# Altium schematic sheet DSP.SchDoc: <title>
size A4; Organization: Institut d'Automatisation Industrielle; SheetNumber: 3; SheetTotal: 3; SVN: OUI; CurrentTime: 6; CurrentDate: 5; DocumentFullPathAndName: 8; DocumentName: 9; ModifiedDate: 13; ProjectName: <projet>
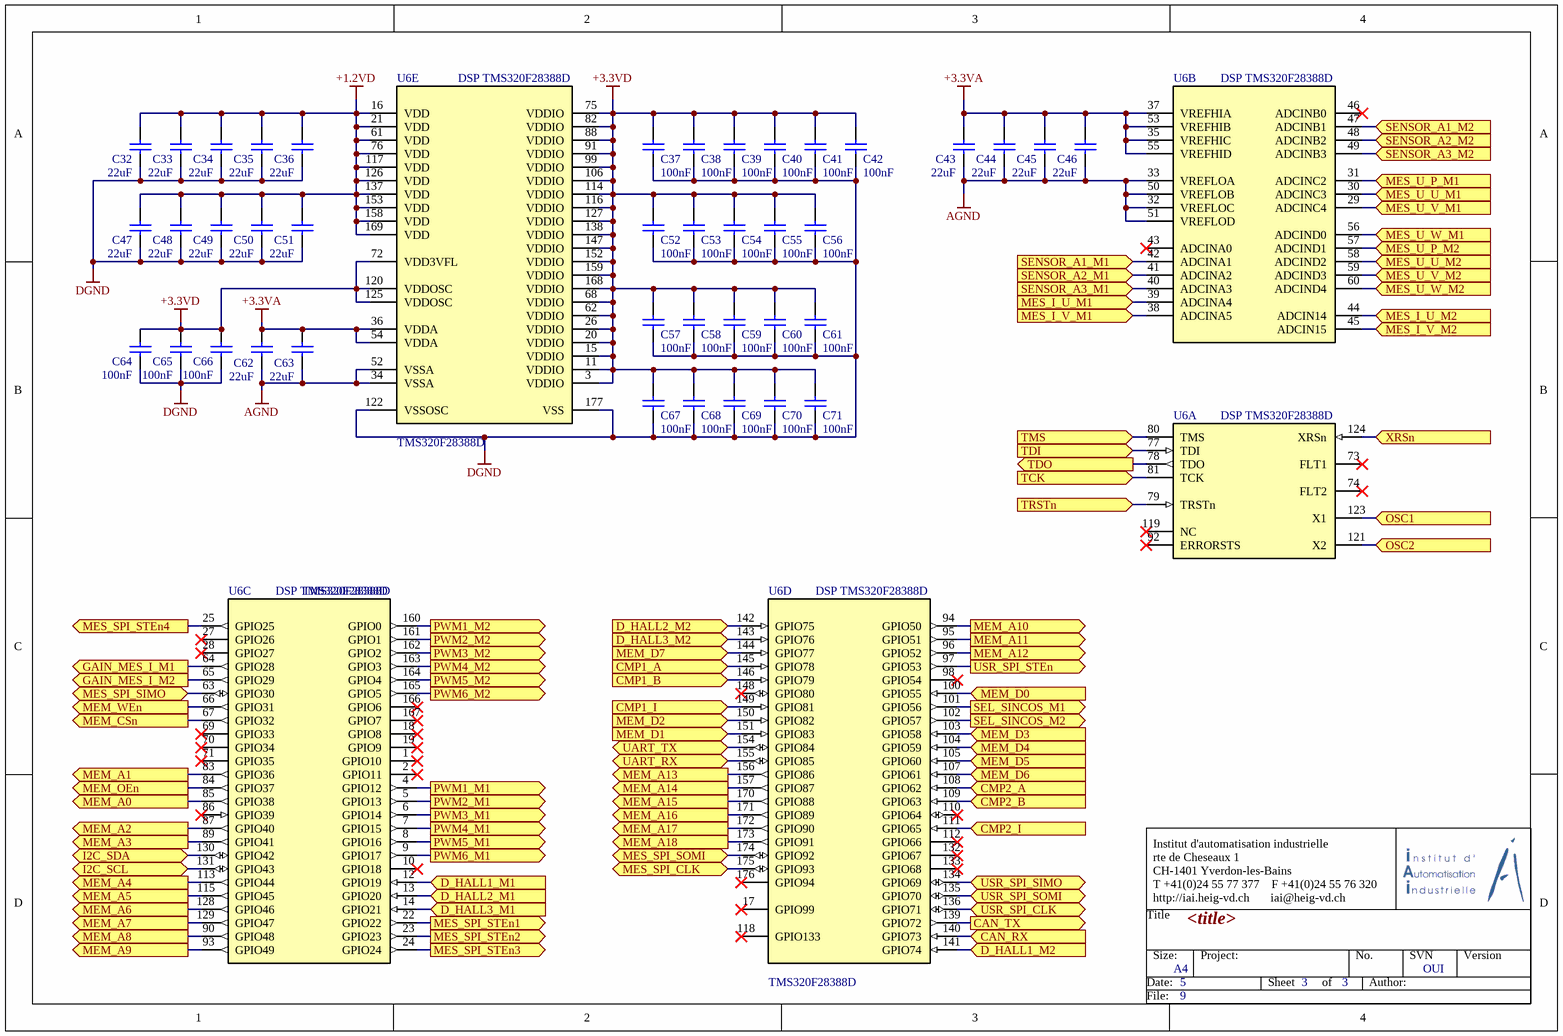
[diagram p0: DSP.SchDoc]

## Parts
C32  value 22uF  [CAPC1608X08N]  (hidden comment: CAP CER 22uF 0603)
C33  value 22uF  [CAPC1608X08N]  (hidden comment: CAP CER 22uF 0603)
C34  value 22uF  [CAPC1608X08N]  (hidden comment: CAP CER 22uF 0603)
C35  value 22uF  [CAPC1608X08N]  (hidden comment: CAP CER 22uF 0603)
C36  value 22uF  [CAPC1608X08N]  (hidden comment: CAP CER 22uF 0603)
C37  value 100nF  [CAPC1608X08N]  (hidden comment: CAP CER 100nF 0603)
C38  value 100nF  [CAPC1608X08N]  (hidden comment: CAP CER 100nF 0603)
C39  value 100nF  [CAPC1608X08N]  (hidden comment: CAP CER 100nF 0603)
C40  value 100nF  [CAPC1608X08N]  (hidden comment: CAP CER 100nF 0603)
C41  value 100nF  [CAPC1608X08N]  (hidden comment: CAP CER 100nF 0603)
C42  value 100nF  [CAPC1608X08N]  (hidden comment: CAP CER 100nF 0603)
C43  value 22uF  [CAPC1608X08N]  (hidden comment: CAP CER 22uF 0603)
C44  value 22uF  [CAPC1608X08N]  (hidden comment: CAP CER 22uF 0603)
C45  value 22uF  [CAPC1608X08N]  (hidden comment: CAP CER 22uF 0603)
C46  value 22uF  [CAPC1608X08N]  (hidden comment: CAP CER 22uF 0603)
C47  value 22uF  [CAPC1608X08N]  (hidden comment: CAP CER 22uF 0603)
C48  value 22uF  [CAPC1608X08N]  (hidden comment: CAP CER 22uF 0603)
C49  value 22uF  [CAPC1608X08N]  (hidden comment: CAP CER 22uF 0603)
C50  value 22uF  [CAPC1608X08N]  (hidden comment: CAP CER 22uF 0603)
C51  value 22uF  [CAPC1608X08N]  (hidden comment: CAP CER 22uF 0603)
C52  value 100nF  [CAPC1608X08N]  (hidden comment: CAP CER 100nF 0603)
C53  value 100nF  [CAPC1608X08N]  (hidden comment: CAP CER 100nF 0603)
C54  value 100nF  [CAPC1608X08N]  (hidden comment: CAP CER 100nF 0603)
C55  value 100nF  [CAPC1608X08N]  (hidden comment: CAP CER 100nF 0603)
C56  value 100nF  [CAPC1608X08N]  (hidden comment: CAP CER 100nF 0603)
C57  value 100nF  [CAPC1608X08N]  (hidden comment: CAP CER 100nF 0603)
C58  value 100nF  [CAPC1608X08N]  (hidden comment: CAP CER 100nF 0603)
C59  value 100nF  [CAPC1608X08N]  (hidden comment: CAP CER 100nF 0603)
C60  value 100nF  [CAPC1608X08N]  (hidden comment: CAP CER 100nF 0603)
C61  value 100nF  [CAPC1608X08N]  (hidden comment: CAP CER 100nF 0603)
C62  value 22uF  [CAPC1608X08N]  (hidden comment: CAP CER 22uF 0603)
C63  value 22uF  [CAPC1608X08N]  (hidden comment: CAP CER 22uF 0603)
C64  value 100nF  [CAPC1608X08N]  (hidden comment: CAP CER 100nF 0603)
C65  value 100nF  [CAPC1608X08N]  (hidden comment: CAP CER 100nF 0603)
C66  value 100nF  [CAPC1608X08N]  (hidden comment: CAP CER 100nF 0603)
C67  value 100nF  [CAPC1608X08N]  (hidden comment: CAP CER 100nF 0603)
C68  value 100nF  [CAPC1608X08N]  (hidden comment: CAP CER 100nF 0603)
C69  value 100nF  [CAPC1608X08N]  (hidden comment: CAP CER 100nF 0603)
C70  value 100nF  [CAPC1608X08N]  (hidden comment: CAP CER 100nF 0603)
C71  value 100nF  [CAPC1608X08N]  (hidden comment: CAP CER 100nF 0603)
U6  DSP TMS320F28388D  [TSQFP50P2600X2600X160_HS-177N]  (parts A,B,C,D,E of 5)

## Ports
CAN_RX (in), CAN_TX (out), CMP1_A (in), CMP1_B (in), CMP1_I (in), CMP2_A (in), CMP2_B (in), CMP2_I (in), D_HALL1_M1 (in), D_HALL1_M2 (in), D_HALL2_M1 (in), D_HALL2_M2 (in), D_HALL3_M1 (in), D_HALL3_M2 (in), GAIN_MES_I_M1 (out), GAIN_MES_I_M2 (out), I2C_SCL (bidir), I2C_SDA (bidir), MEM_A0 (out), MEM_A1 (out), MEM_A2 (out), MEM_A3 (out), MEM_A4 (out), MEM_A5 (out), MEM_A6 (out), MEM_A7 (out), MEM_A8 (out), MEM_A9 (out), MEM_A10 (out), MEM_A11 (out), MEM_A12 (out), MEM_A13 (out), MEM_A14 (out), MEM_A15 (out), MEM_A16 (out), MEM_A17 (out), MEM_A18 (out), MEM_CSn (out), MEM_D0 (in), MEM_D1 (in), MEM_D2 (in), MEM_D3 (in), MEM_D4 (in), MEM_D5 (in), MEM_D6 (in), MEM_D7 (in), MEM_OEn (out), MEM_WEn (out), MES_I_U_M1 (in), MES_I_U_M2 (in), MES_I_V_M1 (in), MES_I_V_M2 (in), MES_SPI_CLK (bidir), MES_SPI_SIMO (bidir), MES_SPI_SOMI (bidir), MES_SPI_STEn1 (out), MES_SPI_STEn2 (out), MES_SPI_STEn3 (out), MES_SPI_STEn4 (out), MES_U_P_M1 (in), MES_U_P_M2 (in), MES_U_U_M1 (in), MES_U_U_M2 (in), MES_U_V_M1 (in), MES_U_V_M2 (in), MES_U_W_M1 (in), MES_U_W_M2 (in), OSC1 (in), OSC2 (in), PWM1_M1 (out), PWM1_M2 (out), PWM2_M1 (out), PWM2_M2 (out), PWM3_M1 (out), PWM3_M2 (out), PWM4_M1 (out), PWM4_M2 (out), PWM5_M1 (out), PWM5_M2 (out), PWM6_M1 (out), PWM6_M2 (out), SEL_SINCOS_M1 (out), SEL_SINCOS_M2 (out), SENSOR_A1_M1 (in), SENSOR_A1_M2 (in), SENSOR_A2_M1 (in), SENSOR_A2_M2 (in), SENSOR_A3_M1 (in), SENSOR_A3_M2 (in), TCK (in), TDI (in), TDO (out), TMS (in), TRSTn (in), UART_RX (bidir), UART_TX (bidir), USR_SPI_CLK (bidir), USR_SPI_SIMO (bidir), USR_SPI_SOMI (bidir), USR_SPI_STEn (out), XRSn (in)

## Nets
+1.2VD: C32.2 C33.2 C34.2 C35.2 C36.2 C47.2 C48.2 C49.2 C50.2 C51.2 U6.16(VDD) U6.21(VDD) U6.61(VDD) U6.76(VDD) U6.117(VDD) U6.126(VDD) U6.137(VDD) U6.153(VDD) U6.158(VDD) U6.169(VDD)
+3.3VA: C43.2 C44.2 C45.2 C46.2 C62.2 C63.2 U6.35(VREFHIC) U6.36(VDDA) U6.37(VREFHIA) U6.53(VREFHIB) U6.54(VDDA) U6.55(VREFHID)
+3.3VD: C37.2 C38.2 C39.2 C40.2 C41.2 C42.2 C52.2 C53.2 C54.2 C55.2 C56.2 C57.2 C58.2 C59.2 C60.2 C61.2 C64.2 C65.2 C66.2 C67.2 C68.2 C69.2 C70.2 C71.2 U6.3(VDDIO) U6.11(VDDIO) U6.15(VDDIO) U6.20(VDDIO) U6.26(VDDIO) U6.62(VDDIO) U6.68(VDDIO) U6.72(VDD3VFL) U6.75(VDDIO) U6.82(VDDIO) U6.88(VDDIO) U6.91(VDDIO) U6.99(VDDIO) U6.106(VDDIO) U6.114(VDDIO) U6.116(VDDIO) U6.120(VDDOSC) U6.125(VDDOSC) U6.127(VDDIO) U6.138(VDDIO) U6.147(VDDIO) U6.152(VDDIO) U6.159(VDDIO) U6.168(VDDIO)
AGND: C43.1 C44.1 C45.1 C46.1 C62.1 C63.1 U6.32(VREFLOC) U6.33(VREFLOA) U6.34(VSSA) U6.50(VREFLOB) U6.51(VREFLOD) U6.52(VSSA)
DGND: C32.1 C33.1 C34.1 C35.1 C36.1 C37.1 C38.1 C39.1 C40.1 C41.1 C42.1 C47.1 C48.1 C49.1 C50.1 C51.1 C52.1 C53.1 C54.1 C55.1 C56.1 C57.1 C58.1 C59.1 C60.1 C61.1 C64.1 C65.1 C66.1 C67.1 C68.1 C69.1 C70.1 C71.1 U6.122(VSSOSC) U6.177(VSS)
CAN_RX: U6.140(GPIO73) ; port CAN_RX
CAN_TX: U6.139(GPIO72) ; port CAN_TX
CMP1_A: U6.145(GPIO78) ; port CMP1_A
CMP1_B: U6.146(GPIO79) ; port CMP1_B
CMP1_I: U6.149(GPIO81) ; port CMP1_I
CMP2_A: U6.108(GPIO62) ; port CMP2_A
CMP2_B: U6.109(GPIO63) ; port CMP2_B
CMP2_I: U6.111(GPIO65) ; port CMP2_I
D_HALL1_M1: U6.12(GPIO19) ; port D_HALL1_M1
D_HALL1_M2: U6.141(GPIO74) ; port D_HALL1_M2
D_HALL2_M1: U6.13(GPIO20) ; port D_HALL2_M1
D_HALL2_M2: U6.142(GPIO75) ; port D_HALL2_M2
D_HALL3_M1: U6.14(GPIO21) ; port D_HALL3_M1
D_HALL3_M2: U6.143(GPIO76) ; port D_HALL3_M2
GAIN_MES_I_M1: U6.64(GPIO28) ; port GAIN_MES_I_M1
GAIN_MES_I_M2: U6.65(GPIO29) ; port GAIN_MES_I_M2
I2C_SCL: U6.131(GPIO43) ; port I2C_SCL
I2C_SDA: U6.130(GPIO42) ; port I2C_SDA
MEM_A0: U6.85(GPIO38) ; port MEM_A0
MEM_A1: U6.83(GPIO36) ; port MEM_A1
MEM_A2: U6.87(GPIO40) ; port MEM_A2
MEM_A3: U6.89(GPIO41) ; port MEM_A3
MEM_A4: U6.113(GPIO44) ; port MEM_A4
MEM_A5: U6.115(GPIO45) ; port MEM_A5
MEM_A6: U6.128(GPIO46) ; port MEM_A6
MEM_A7: U6.129(GPIO47) ; port MEM_A7
MEM_A8: U6.90(GPIO48) ; port MEM_A8
MEM_A9: U6.93(GPIO49) ; port MEM_A9
MEM_A10: U6.94(GPIO50) ; port MEM_A10
MEM_A11: U6.95(GPIO51) ; port MEM_A11
MEM_A12: U6.96(GPIO52) ; port MEM_A12
MEM_A13: U6.156(GPIO86) ; port MEM_A13
MEM_A14: U6.157(GPIO87) ; port MEM_A14
MEM_A15: U6.170(GPIO88) ; port MEM_A15
MEM_A16: U6.171(GPIO89) ; port MEM_A16
MEM_A17: U6.172(GPIO90) ; port MEM_A17
MEM_A18: U6.173(GPIO91) ; port MEM_A18
MEM_CSn: U6.67(GPIO32) ; port MEM_CSn
MEM_D0: U6.100(GPIO55) ; port MEM_D0
MEM_D1: U6.151(GPIO83) ; port MEM_D1
MEM_D2: U6.150(GPIO82) ; port MEM_D2
MEM_D3: U6.103(GPIO58) ; port MEM_D3
MEM_D4: U6.104(GPIO59) ; port MEM_D4
MEM_D5: U6.105(GPIO60) ; port MEM_D5
MEM_D6: U6.107(GPIO61) ; port MEM_D6
MEM_D7: U6.144(GPIO77) ; port MEM_D7
MEM_OEn: U6.84(GPIO37) ; port MEM_OEn
MEM_WEn: U6.66(GPIO31) ; port MEM_WEn
MES_I_U_M1: U6.39(ADCINA4) ; port MES_I_U_M1
MES_I_U_M2: U6.44(ADCIN14) ; port MES_I_U_M2
MES_I_V_M1: U6.38(ADCINA5) ; port MES_I_V_M1
MES_I_V_M2: U6.45(ADCIN15) ; port MES_I_V_M2
MES_SPI_CLK: U6.175(GPIO93) ; port MES_SPI_CLK
MES_SPI_SIMO: U6.63(GPIO30) ; port MES_SPI_SIMO
MES_SPI_SOMI: U6.174(GPIO92) ; port MES_SPI_SOMI
MES_SPI_STEn1: U6.22(GPIO22) ; port MES_SPI_STEn1
MES_SPI_STEn2: U6.23(GPIO23) ; port MES_SPI_STEn2
MES_SPI_STEn3: U6.24(GPIO24) ; port MES_SPI_STEn3
MES_SPI_STEn4: U6.25(GPIO25) ; port MES_SPI_STEn4
MES_U_P_M1: U6.31(ADCINC2) ; port MES_U_P_M1
MES_U_P_M2: U6.57(ADCIND1) ; port MES_U_P_M2
MES_U_U_M1: U6.30(ADCINC3) ; port MES_U_U_M1
MES_U_U_M2: U6.58(ADCIND2) ; port MES_U_U_M2
MES_U_V_M1: U6.29(ADCINC4) ; port MES_U_V_M1
MES_U_V_M2: U6.59(ADCIND3) ; port MES_U_V_M2
MES_U_W_M1: U6.56(ADCIND0) ; port MES_U_W_M1
MES_U_W_M2: U6.60(ADCIND4) ; port MES_U_W_M2
OSC1: U6.123(X1) ; port OSC1
OSC2: U6.121(X2) ; port OSC2
PWM1_M1: U6.4(GPIO12) ; port PWM1_M1
PWM1_M2: U6.160(GPIO0) ; port PWM1_M2
PWM2_M1: U6.5(GPIO13) ; port PWM2_M1
PWM2_M2: U6.161(GPIO1) ; port PWM2_M2
PWM3_M1: U6.6(GPIO14) ; port PWM3_M1
PWM3_M2: U6.162(GPIO2) ; port PWM3_M2
PWM4_M1: U6.7(GPIO15) ; port PWM4_M1
PWM4_M2: U6.163(GPIO3) ; port PWM4_M2
PWM5_M1: U6.8(GPIO16) ; port PWM5_M1
PWM5_M2: U6.164(GPIO4) ; port PWM5_M2
PWM6_M1: U6.9(GPIO17) ; port PWM6_M1
PWM6_M2: U6.165(GPIO5) ; port PWM6_M2
SEL_SINCOS_M1: U6.101(GPIO56) ; port SEL_SINCOS_M1
SEL_SINCOS_M2: U6.102(GPIO57) ; port SEL_SINCOS_M2
SENSOR_A1_M1: U6.42(ADCINA1) ; port SENSOR_A1_M1
SENSOR_A1_M2: U6.47(ADCINB1) ; port SENSOR_A1_M2
SENSOR_A2_M1: U6.41(ADCINA2) ; port SENSOR_A2_M1
SENSOR_A2_M2: U6.48(ADCINB2) ; port SENSOR_A2_M2
SENSOR_A3_M1: U6.40(ADCINA3) ; port SENSOR_A3_M1
SENSOR_A3_M2: U6.49(ADCINB3) ; port SENSOR_A3_M2
TCK: U6.81(TCK) ; port TCK
TDI: U6.77(TDI) ; port TDI
TDO: U6.78(TDO) ; port TDO
TMS: U6.80(TMS) ; port TMS
TRSTn: U6.79(TRSTn) ; port TRSTn
UART_RX: U6.155(GPIO85) ; port UART_RX
UART_TX: U6.154(GPIO84) ; port UART_TX
USR_SPI_CLK: U6.136(GPIO71) ; port USR_SPI_CLK
USR_SPI_SIMO: U6.134(GPIO69) ; port USR_SPI_SIMO
USR_SPI_SOMI: U6.135(GPIO70) ; port USR_SPI_SOMI
USR_SPI_STEn: U6.97(GPIO53) ; port USR_SPI_STEn
XRSn: U6.124(XRSn) ; port XRSn

Not connected (* = marked no-connect by the designer): U6 1(GPIO10)* 2(GPIO11)* 10(GPIO18)* 17(GPIO99)* 18(GPIO8)* 19(GPIO9)* 27(GPIO26)* 28(GPIO27)* 43(ADCINA0)* 46(ADCINB0)* 69(GPIO33)* 70(GPIO34)* 71(GPIO35)* 73(FLT1)* 74(FLT2)* 86(GPIO39)* 92(ERRORSTS)* 98(GPIO54)* 110(GPIO64)* 112(GPIO66)* 118(GPIO133)* 119(NC)* 132(GPIO67)* 133(GPIO68)* 148(GPIO80)* 166(GPIO6)* 167(GPIO7)* 176(GPIO94)*

## Notes on the sheet
- Title
- Institut d'automatisation industrielle
  rte de Cheseaux 1
  CH-1401 Yverdon-les-Bains
  T +41(0)24 55 77 377    F +41(0)24 55 76 320
  http://iai.heig-vd.ch       iai@heig-vd.ch
- Date:
- Size:
- A4
- Project:
- Sheet
- of
- No.
- Author:
- SVN
- Version
- File:

## Library data of the parts
C32-C36 C43-C51 C62 C63 = CAP CER 22uF 20% 6V3 0603: 22µF ±20% 6,3V Condensateurs céramique X5R 0603 (1608 métrique); Supplier 1: Digi-Key; Supplier Part Number 1: 399-14498-1-ND
C37-C42 C52-C61 C64-C71 = CAP CER 100nF 10% 10V 0603: 0,1µF ±10% 10V Condensateurs céramique X7R 0603 (1608 métrique); Supplier 1: Digi-Key; Supplier Part Number 1: 399-1095-1-ND
U6 = DSP TMS320F28388D: Microcontrôleurs ARM - MCU C2000 32-bit MCU w/ connectivity manager, 2x C28x+CLA CPU, 1.5-MB flash, FPU64, CLB, ENET, EtherCAT 176-HLQFP -40 to 125 °C; Value: TMS320F28388D